# Altium schematic sheet Power.SchDoc
size A
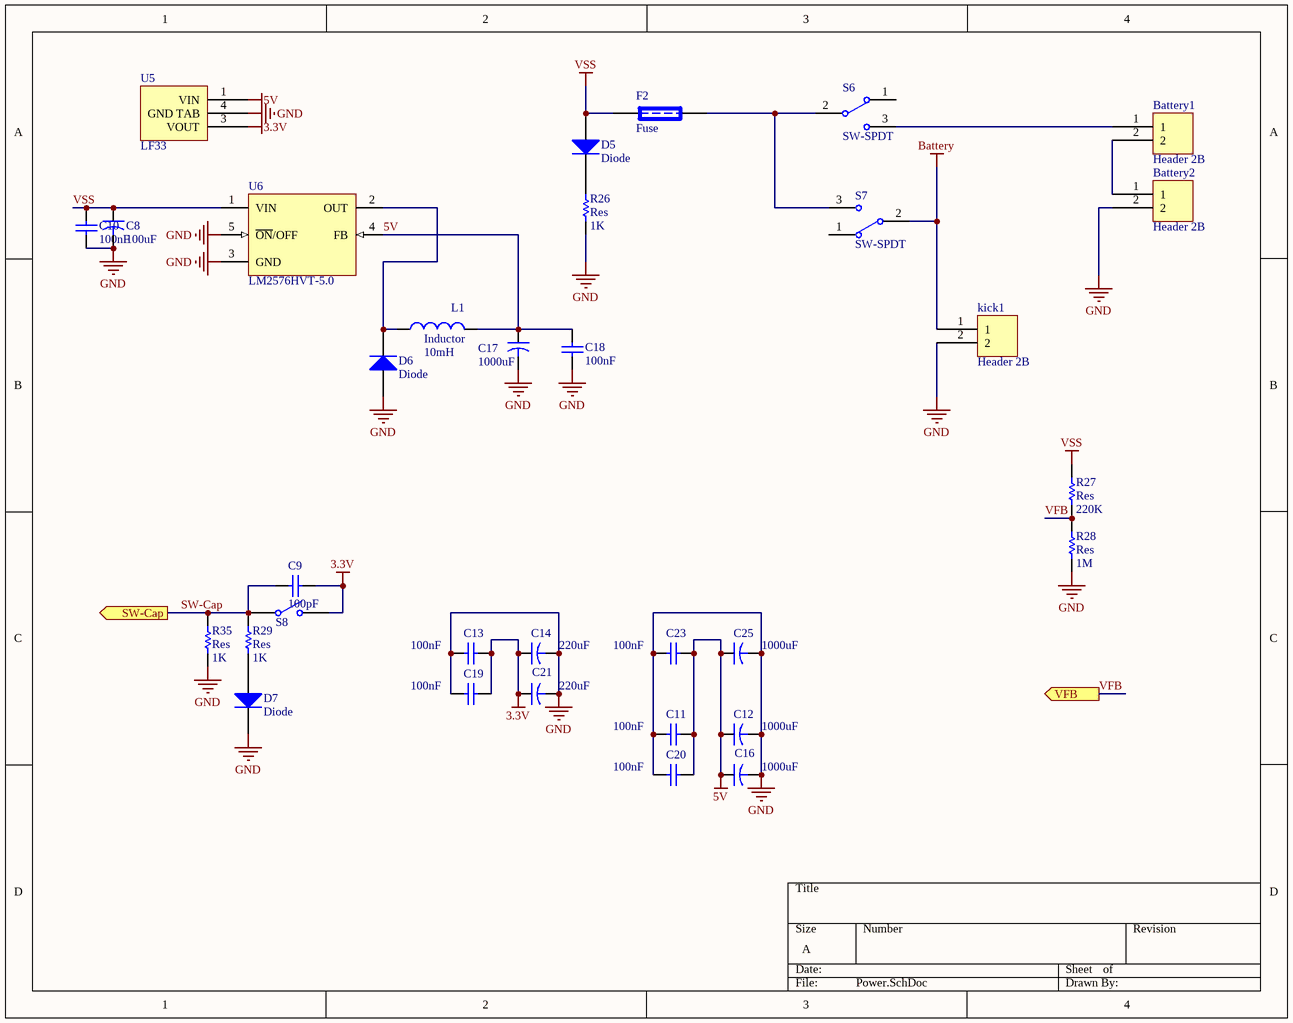
[diagram p0: Power.SchDoc]

## Parts
Battery1  Header 2B  [BHDR1X2]
Battery2  Header 2B  [BHDR1X2]
C8  value 100uF  [Cap1000u-16]  (hidden comment: Cap_El)
C9  value 100pF  [2012[0805]]  (hidden comment: Cap_UP)
C10  value 100nF  [2012[0805]]  (hidden comment: Cap_UP)
C11  value 100nF  [2012[0805]]  (hidden comment: Cap_UP)
C12  value 1000uF  [7343]  (hidden comment: Cap_El)
C13  value 100nF  [2012[0805]]  (hidden comment: Cap_UP)
C14  value 220uF  [7343]  (hidden comment: Cap_El)
C16  value 1000uF  [7343]  (hidden comment: Cap_El)
C17  value 1000uF  [7343]  (hidden comment: Cap_El)
C18  value 100nF  [2012[0805]]  (hidden comment: Cap_UP)
C19  value 100nF  [2012[0805]]  (hidden comment: Cap_UP)
C20  value 100nF  [2012[0805]]  (hidden comment: Cap_UP)
C21  value 220uF  [7343]  (hidden comment: Cap_El)
C23  value 100nF  [2012[0805]]  (hidden comment: Cap_UP)
C25  value 1000uF  [7343]  (hidden comment: Cap_El)
D5  Diode  [2012[0805]]
D6  Diode  [US1M]
D7  Diode  [2012[0805]]
F2  Fuse  [fuse kh]
kick1  Header 2B  [BHDR1X2]
L1  Inductor  value 10mH  [inductor]
R26  Res  value 1K  [2012[0805]]
R27  Res  value 220K  [2012[0805]]
R28  Res  value 1M  [2012[0805]]
R29  Res  value 1K  [2012[0805]]
R35  Res  value 1K  [2012[0805]]
S6  SW-SPDT  [KEYKHRAB]
S7  SW-SPDT  [KEYKHRAB]
S8  SW-SPST  [push button B]  (value not drawn)
U5  LF33  [D-PACK]
U6  LM2576HVT-5.0  [T05A]

## Ports
SW-Cap (out), VFB (out)

## Nets
3.3V: C9.2 C13.2 C14.1 C19.2 C21.1 S8.2(NO) U5.3(VOUT)
5V: C11.2 C12.1 C16.1 C17.1 C18.2 C20.2 C23.2 C25.1 L1.2 U5.1(VIN) U6.4(FB)
Battery: kick1.1 S7.2
GND: Battery2.2 C8.2 C10.1 C11.1 C12.2 C13.1 C14.2 C16.2 C17.2 C18.1 C19.1 C20.1 C21.2 C23.1 C25.2 D6.1(A) D7.2(K) kick1.2 R26.1 R28.1 R35.1 U5.4(GND_TAB) U6.3(GND) U6.5(~{ON}/OFF)
VSS: C8.1 C10.2 D5.1(A) F2.1 R27.2 U6.1(VIN)
SW-Cap: C9.1 R29.2 R35.2 S8.1(COMMON) ; port SW-Cap
VFB: R27.1 R28.2 ; port VFB
NetBattery1_1: Battery1.1 S6.3
NetBattery1_2: Battery1.2 Battery2.1
NetD5_2: D5.2(K) R26.2
NetD6_2: D6.2(K) L1.1 U6.2(OUT)
NetD7_1: D7.1(A) R29.1
NetF2_2: F2.2 S6.2 S7.3

Not connected (* = marked no-connect by the designer): S6 1(3); S7 1(3)

## Library data of the parts
C8 C12 C14 C16 C17 C21 C25 = Cap_El: Capacitor; Published: 23-Sep-2002; PackageReference: CAPR5-4X5; Publisher: Altium Limited
C9-C11 C13 C18-C20 C23 = Cap_UP: Capacitor; Published: 8-Jun-2000; LatestRevisionDate: 17-Jul-2002; LatestRevisionNote: Re-released for DXP Platform.; PackageReference: RAD-0.3; Publisher: Altium Limited
D5-D7 = Diode: 1 Amp General Purpose Rectifier; Revision 1: 11-Jul-2000: SIM Model Added.; Revision 2: 17-Jul-2002: Re-released for DXP Platform.; Package Information: Latest Revision: Aug-1999; Code - JEDEC: DO-204-AL; Published: 8-Jun-2000; Datasheet: Latest Revision: 1998; Package Reference: DO-41; Publisher: Altium Limited
L1 = Inductor: Code_IEC: 1005; Published: 8-Jun-2000; LatestRevisionDate: 17-Jul-2002; LatestRevisionNote: Re-released for DXP Platform.; PackageReference: 0402-A; Publisher: Altium Limited; Code_JEITA: 0402
R26-R29 R35 = Res: Semiconductor Resistor; Published: 8-Jun-2000; LatestRevisionDate: 17-Jul-2002; LatestRevisionNote: Re-released for DXP Platform.; PackageReference: AXIAL-0.5; Publisher: Altium Limited
S6 S7 = SW-SPDT: SPDT Subminiature Toggle Switch, Right Angle Mounting, Vertical Actuation; Published: 24-Mar-1999; LatestRevisionDate: 17-Dec-2003; LatestRevisionNote: Schematic revised, PCB Footprint replaced.; DatasheetDocument: 05-Dec-2000; PackageReference: TL36WW15050; Publisher: Altium Limited; ComponentLink1Description: Manufacturer Link; ComponentLink1URL: http://www.apem.com
S8 = SW-SPST: Single-Pole, Single-Throw Switch; Published: 24-Mar-1999; Revision: July-2002: Re-released for DXP Platform.; Publisher: Altium Limited
U5 = 7805
U6 = LM2576HVT-5.0: SIMPLE SWITCHER; 3A Step-Down Voltage Regulator; Manufacturer: National Semiconductor; PackageTopMarking: NSUZXYTT*LM2576HVT*-5.0 P+; Published: 27-Nov-2008; DatasheetVersion: Aug-2004; PackageVersion: revJ, Jan-1992; PackageReference: T05A; Publisher: Altium Limited; PackageDescription: TO-220, Molded, 5 Lead, Straight; CompType: Switcher; PartNumber: LM2576HVT-5.0; RoHS: O; PinCount: 5; DigiKeyPartNumber: LM2576HVT-5.0-ND; Code_JEDEC: TO-220-AB; ComponentLink1Description: LM2576HV Datasheet; ComponentLink1URL: http://www.national.com/ds/LM/LM2576HV.pdf; ComponentLink2Description: LM2576HV Web Page; ComponentLink2URL: http://www.national.com/pf/LM/LM2576HV.html; ComponentLink3Description: T05A Package Page; ComponentLink3URL: http://www.national.com/packaging/folders/t05a.html
F2 = Fuse: Published: 8-Jun-2000; LatestRevisionDate: 17-Jul-2002; LatestRevisionNote: Re-released for DXP Platform.; PackageReference: PIN-W2/E2.8; Publisher: Altium Limited